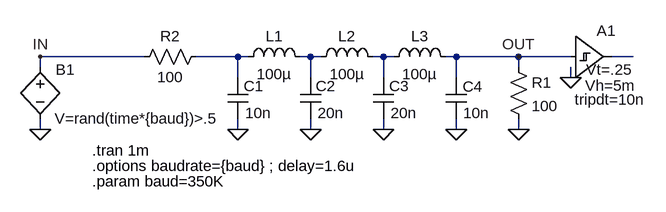
[diagram p0: schematic BaseBandEye.asc]
BaseBandEye.asc, the LTspice schematic file:
Version 4
SHEET 1 1672 1576
WIRE 16 896 16 880
WIRE 16 992 16 976
WIRE 176 880 16 880
WIRE 320 880 256 880
WIRE 320 912 320 880
WIRE 320 992 320 976
WIRE 336 880 320 880
WIRE 432 880 416 880
WIRE 432 912 432 880
WIRE 432 992 432 976
WIRE 448 880 432 880
WIRE 544 880 528 880
WIRE 544 912 544 880
WIRE 544 992 544 976
WIRE 560 880 544 880
WIRE 656 880 640 880
WIRE 656 912 656 880
WIRE 656 992 656 976
WIRE 752 880 656 880
WIRE 752 896 752 880
WIRE 752 992 752 976
WIRE 832 880 752 880
WIRE 832 912 832 896
WIRE 928 880 896 880
FLAG 16 992 0
FLAG 16 880 IN
FLAG 752 992 0
FLAG 432 992 0
FLAG 320 992 0
FLAG 544 992 0
FLAG 656 992 0
FLAG 752 880 OUT
FLAG 832 912 0
SYMBOL cap 304 912 R0
WINDOW 3 27 55 Left 0
WINDOW 0 25 13 Left 0
SYMATTR Value 10n
SYMATTR InstName C1
SYMBOL ind 320 896 R270
WINDOW 0 32 56 VTop 0
WINDOW 3 5 56 VBottom 0
SYMATTR InstName L1
SYMATTR Value 100µ
SYMBOL res 736 880 R0
SYMATTR InstName R1
SYMATTR Value 100
SYMBOL res 272 864 R90
WINDOW 0 0 56 VBottom 0
WINDOW 3 32 56 VTop 0
SYMATTR InstName R2
SYMATTR Value 100
SYMBOL ind 432 896 R270
WINDOW 0 32 56 VTop 0
WINDOW 3 5 56 VBottom 0
SYMATTR InstName L2
SYMATTR Value 100µ
SYMBOL ind 544 896 R270
WINDOW 0 32 56 VTop 0
WINDOW 3 5 56 VBottom 0
SYMATTR InstName L3
SYMATTR Value 100µ
SYMBOL cap 640 912 R0
WINDOW 3 27 55 Left 0
WINDOW 0 26 14 Left 0
SYMATTR Value 10n
SYMATTR InstName C4
SYMBOL cap 416 912 R0
WINDOW 3 27 55 Left 0
WINDOW 0 24 13 Left 0
SYMATTR Value 20n
SYMATTR InstName C2
SYMBOL cap 528 912 R0
WINDOW 3 27 55 Left 0
WINDOW 0 25 13 Left 0
SYMATTR Value 20n
SYMATTR InstName C3
SYMBOL bv 16 880 R0
WINDOW 0 24 20 Left 0
WINDOW 3 22 95 Left 0
SYMATTR InstName B1
SYMATTR Value V=rand(time*{baud})>.5
SYMATTR Value2 tripdt=1n tripdv=.5
SYMBOL digital\\schmtbuf 832 816 R0
WINDOW 3 24 84 Left 0
WINDOW 123 22 108 Left 0
WINDOW 39 6 130 Left 0
SYMATTR InstName A1
SYMATTR Value Vt=.25
SYMATTR Value2 Vh=5m
SYMATTR SpiceLine tripdt=10n
TEXT 96 1024 Left 0 !.tran 1m
TEXT 96 1048 Left 0 !.options baudrate={baud} ; delay=1.6u
TEXT 96 1072 Left 0 !.param baud=350K

The netlist it stands for:
* BaseBandEye.asc
C1 N001 0 10n
L1 N001 N002 100µ
R1 OUT 0 100
R2 N001 IN 100
L2 N002 N003 100µ
L3 N003 OUT 100µ
C4 OUT 0 10n
C2 N002 0 20n
C3 N003 0 20n
B1 IN 0 V=rand(time*{baud})>.5 tripdt=1n tripdv=.5
A1 OUT 0 0 0 0 0 N004 0 SCHMITT Vt=.25 Vh=5m tripdt=10n
.tran 1m
.options baudrate={baud} ; delay=1.6u
.param baud=350K
.backanno
.end